# Altium schematic sheet AD_1.SchDoc
size A2; Date: Date; CompanyName: HESSO; Engineer: Name; Address1: Route du Rawyl 47; Address2: 1950 Sion; Address3: Switzerland; DocumentNumber: 6; SheetNumber: 6; SheetTotal: 8; ProjectName: Project Name
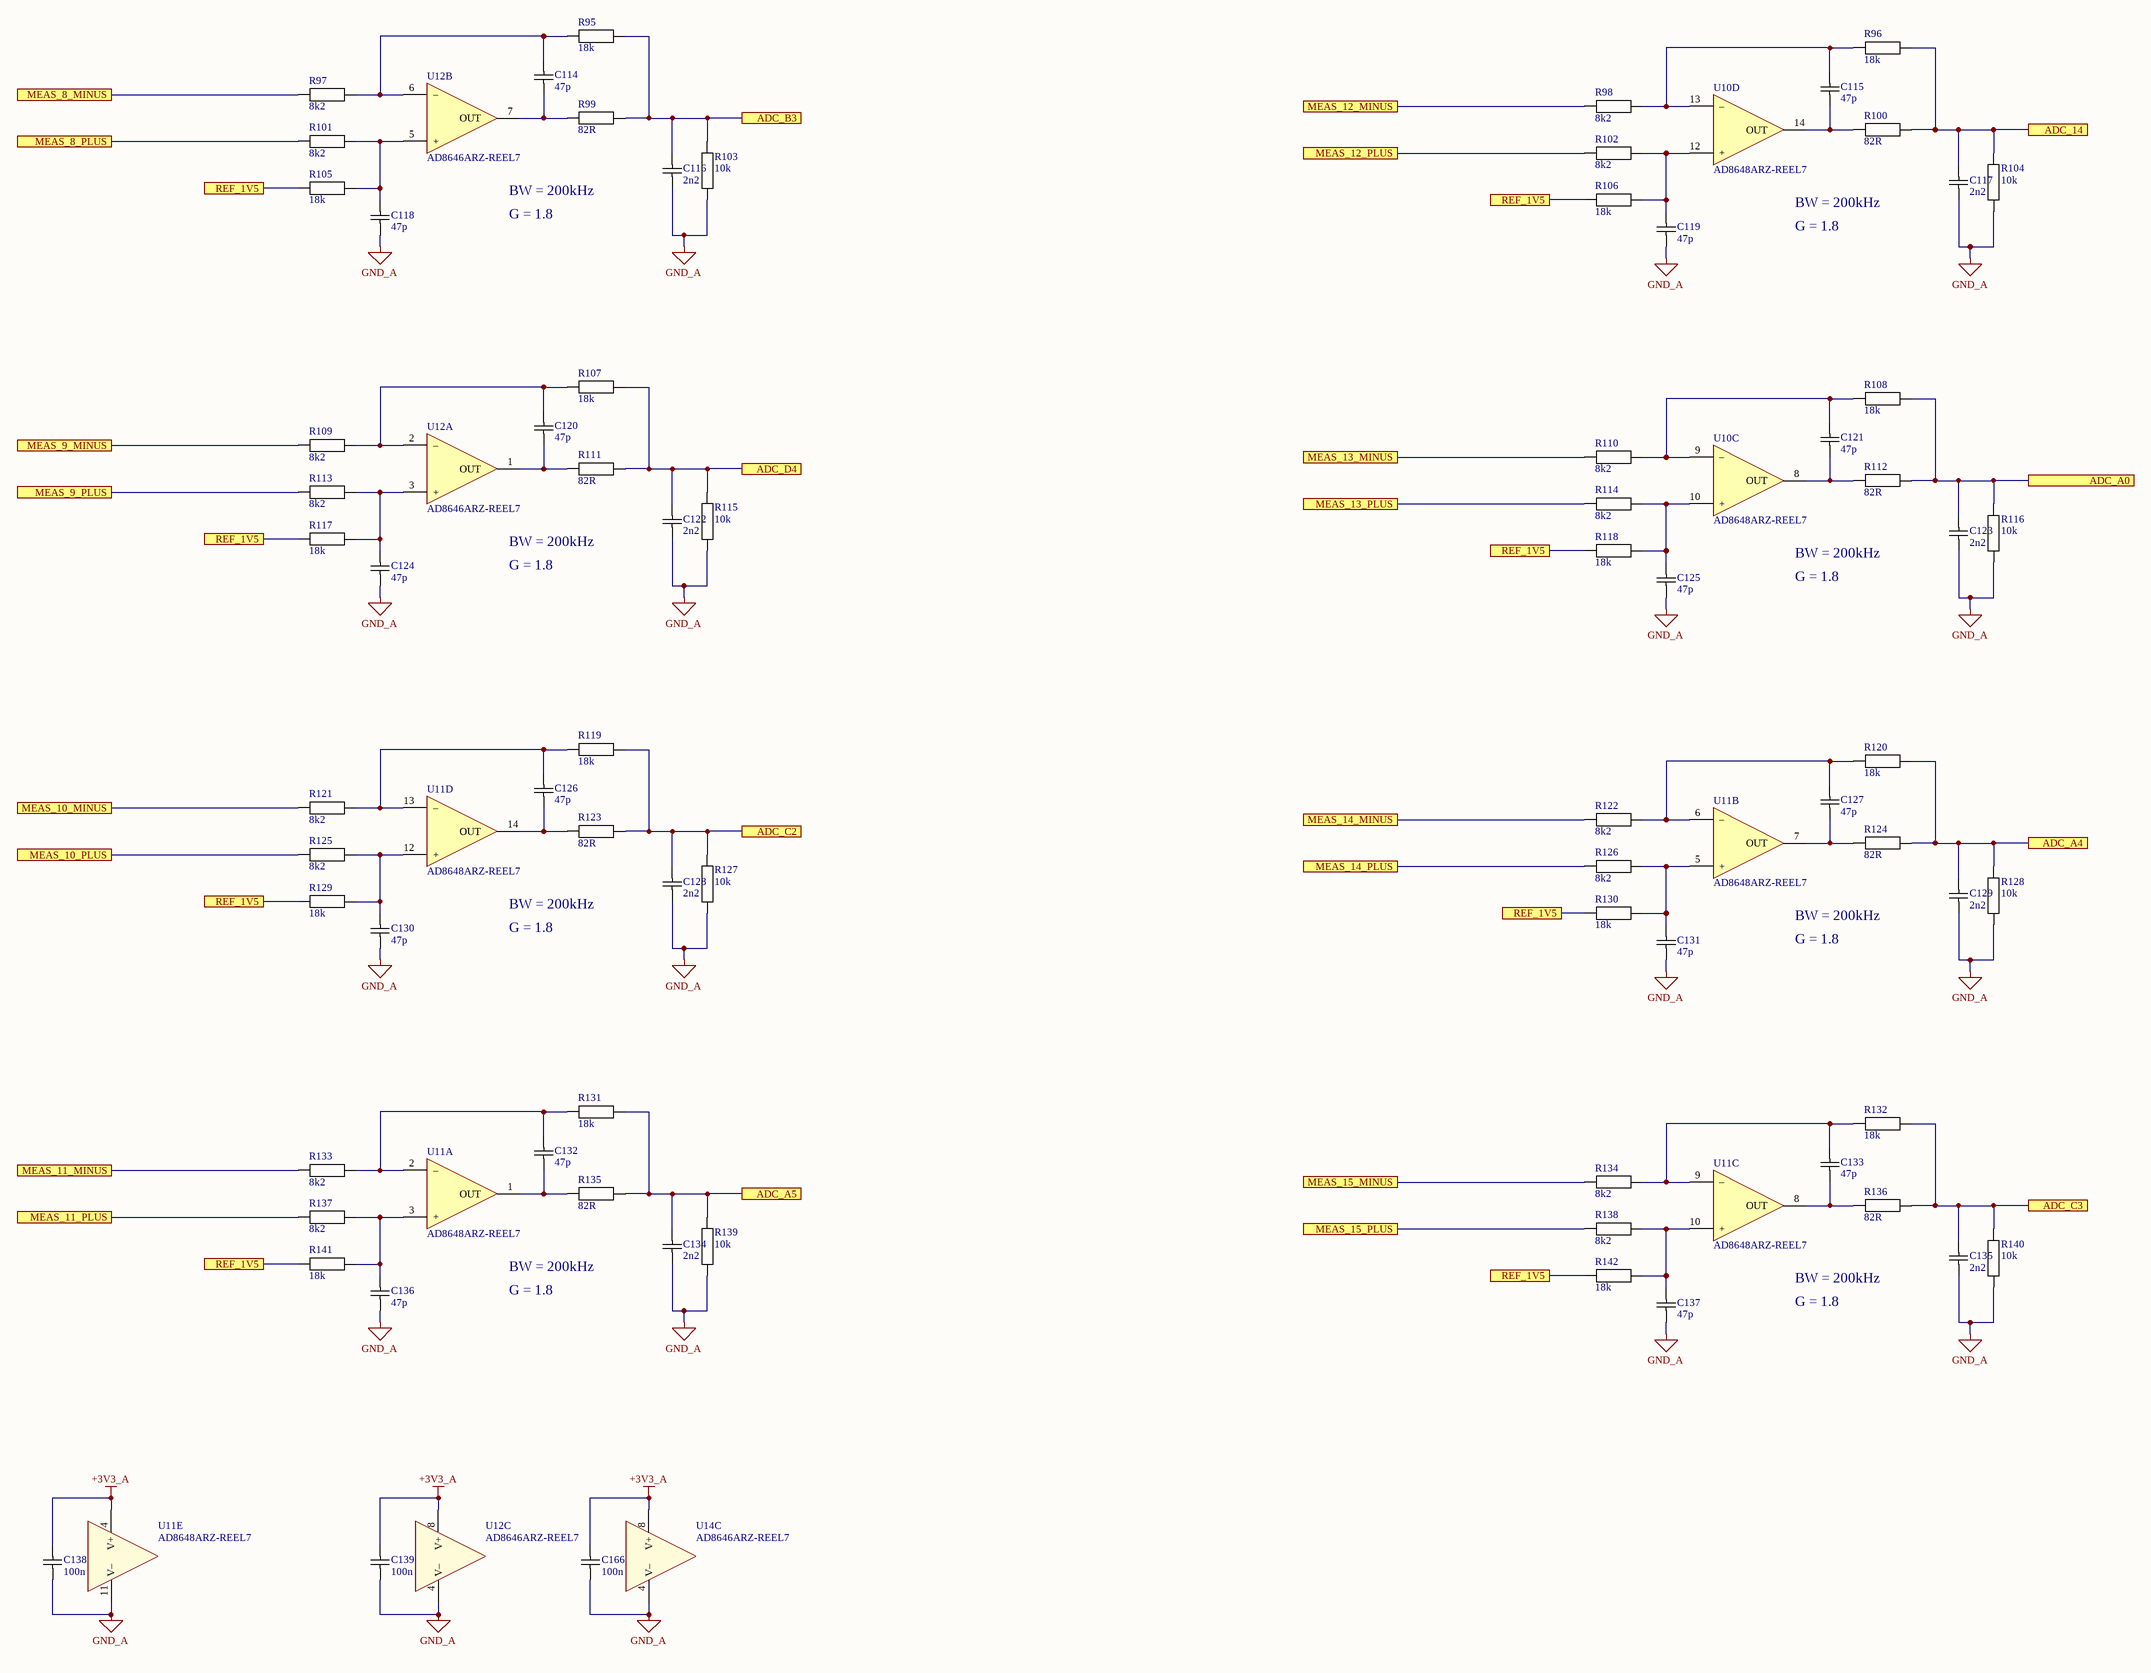
[diagram p0: AD_1.SchDoc]

## Parts
C114  47p  [CAPACITOR 1608 REFLOW]
C115  47p  [CAPACITOR 1608 REFLOW]
C116  2n2  [CAPACITOR 1608 REFLOW]
C117  2n2  [CAPACITOR 1608 REFLOW]
C118  47p  [CAPACITOR 1608 REFLOW]
C119  47p  [CAPACITOR 1608 REFLOW]
C120  47p  [CAPACITOR 1608 REFLOW]
C121  47p  [CAPACITOR 1608 REFLOW]
C122  2n2  [CAPACITOR 1608 REFLOW]
C123  2n2  [CAPACITOR 1608 REFLOW]
C124  47p  [CAPACITOR 1608 REFLOW]
C125  47p  [CAPACITOR 1608 REFLOW]
C126  47p  [CAPACITOR 1608 REFLOW]
C127  47p  [CAPACITOR 1608 REFLOW]
C128  2n2  [CAPACITOR 1608 REFLOW]
C129  2n2  [CAPACITOR 1608 REFLOW]
C130  47p  [CAPACITOR 1608 REFLOW]
C131  47p  [CAPACITOR 1608 REFLOW]
C132  47p  [CAPACITOR 1608 REFLOW]
C133  47p  [CAPACITOR 1608 REFLOW]
C134  2n2  [CAPACITOR 1608 REFLOW]
C135  2n2  [CAPACITOR 1608 REFLOW]
C136  47p  [CAPACITOR 1608 REFLOW]
C137  47p  [CAPACITOR 1608 REFLOW]
C138  100n  [CAPACITOR 1608 REFLOW]
C139  100n  [CAPACITOR 1608 REFLOW]
C166  100n  [CAPACITOR 1608 REFLOW]
R95  18k  [RESISTOR 1608 REFLOW]
R96  18k  [RESISTOR 1608 REFLOW]
R97  8k2  [RESISTOR 1608 REFLOW]
R98  8k2  [RESISTOR 1608 REFLOW]
R99  82R  [RESISTOR 1608 REFLOW]
R100  82R  [RESISTOR 1608 REFLOW]
R101  8k2  [RESISTOR 1608 REFLOW]
R102  8k2  [RESISTOR 1608 REFLOW]
R103  10k  [RESISTOR 1608 REFLOW]
R104  10k  [RESISTOR 1608 REFLOW]
R105  18k  [RESISTOR 1608 REFLOW]
R106  18k  [RESISTOR 1608 REFLOW]
R107  18k  [RESISTOR 1608 REFLOW]
R108  18k  [RESISTOR 1608 REFLOW]
R109  8k2  [RESISTOR 1608 REFLOW]
R110  8k2  [RESISTOR 1608 REFLOW]
R111  82R  [RESISTOR 1608 REFLOW]
R112  82R  [RESISTOR 1608 REFLOW]
R113  8k2  [RESISTOR 1608 REFLOW]
R114  8k2  [RESISTOR 1608 REFLOW]
R115  10k  [RESISTOR 1608 REFLOW]
R116  10k  [RESISTOR 1608 REFLOW]
R117  18k  [RESISTOR 1608 REFLOW]
R118  18k  [RESISTOR 1608 REFLOW]
R119  18k  [RESISTOR 1608 REFLOW]
R120  18k  [RESISTOR 1608 REFLOW]
R121  8k2  [RESISTOR 1608 REFLOW]
R122  8k2  [RESISTOR 1608 REFLOW]
R123  82R  [RESISTOR 1608 REFLOW]
R124  82R  [RESISTOR 1608 REFLOW]
R125  8k2  [RESISTOR 1608 REFLOW]
R126  8k2  [RESISTOR 1608 REFLOW]
R127  10k  [RESISTOR 1608 REFLOW]
R128  10k  [RESISTOR 1608 REFLOW]
R129  18k  [RESISTOR 1608 REFLOW]
R130  18k  [RESISTOR 1608 REFLOW]
R131  18k  [RESISTOR 1608 REFLOW]
R132  18k  [RESISTOR 1608 REFLOW]
R133  8k2  [RESISTOR 1608 REFLOW]
R134  8k2  [RESISTOR 1608 REFLOW]
R135  82R  [RESISTOR 1608 REFLOW]
R136  82R  [RESISTOR 1608 REFLOW]
R137  8k2  [RESISTOR 1608 REFLOW]
R138  8k2  [RESISTOR 1608 REFLOW]
R139  10k  [RESISTOR 1608 REFLOW]
R140  10k  [RESISTOR 1608 REFLOW]
R141  18k  [RESISTOR 1608 REFLOW]
R142  18k  [RESISTOR 1608 REFLOW]
U10  AD8648ARZ-REEL7  [SO14 P1.27 C4.0X8.8 H1.75]  (parts C,D of 5)
U11  AD8648ARZ-REEL7  [SO14 P1.27 C4.0X8.8 H1.75]  (parts A,B,C,D,E of 5)
U12  AD8646ARZ-REEL7  [SO8 P1.27 C4.0X5.0 H1.75]  (parts A,B,C of 3)
U14  AD8646ARZ-REEL7  [SO8 P1.27 C4.0X5.0 H1.75]  (part C of 3)

## Ports
ADC_14, ADC_A0, ADC_A4, ADC_A5, ADC_B3, ADC_C2, ADC_C3, ADC_D4, MEAS_8_MINUS, MEAS_8_PLUS, MEAS_9_MINUS, MEAS_9_PLUS, MEAS_10_MINUS, MEAS_10_PLUS, MEAS_11_MINUS, MEAS_11_PLUS, MEAS_12_MINUS, MEAS_12_PLUS, MEAS_13_MINUS, MEAS_13_PLUS, MEAS_14_MINUS, MEAS_14_PLUS, MEAS_15_MINUS, MEAS_15_PLUS, REF_1V5

## Nets
+3V3_A: C138.2 C139.2 C166.2 U11.4(V+) U12.8(V+) U14.8(V+)
GND_A: C116.1 C117.1 C118.1 C119.1 C122.1 C123.1 C124.1 C125.1 C128.1 C129.1 C130.1 C131.1 C134.1 C135.1 C136.1 C137.1 C138.1 C139.1 C166.1 R103.2 R104.2 R115.2 R116.2 R127.2 R128.2 R139.2 R140.2 U11.11(V–) U12.4(V–) U14.4(V–)
ADC_14: C117.2 R96.2 R100.2 R104.1 ; port ADC_14
ADC_A0: C123.2 R108.2 R112.2 R116.1 ; port ADC_A0
ADC_A4: C129.2 R120.2 R124.2 R128.1 ; port ADC_A4
ADC_A5: C134.2 R131.2 R135.2 R139.1 ; port ADC_A5
ADC_B3: C116.2 R95.2 R99.2 R103.1 ; port ADC_B3
ADC_C2: C128.2 R119.2 R123.2 R127.1 ; port ADC_C2
ADC_C3: C135.2 R132.2 R136.2 R140.1 ; port ADC_C3
ADC_D4: C122.2 R107.2 R111.2 R115.1 ; port ADC_D4
MEAS_8_MINUS: R97.1 ; port MEAS_8_MINUS
MEAS_8_PLUS: R101.1 ; port MEAS_8_PLUS
MEAS_9_MINUS: R109.1 ; port MEAS_9_MINUS
MEAS_9_PLUS: R113.1 ; port MEAS_9_PLUS
MEAS_10_MINUS: R121.1 ; port MEAS_10_MINUS
MEAS_10_PLUS: R125.1 ; port MEAS_10_PLUS
MEAS_11_MINUS: R133.1 ; port MEAS_11_MINUS
MEAS_11_PLUS: R137.1 ; port MEAS_11_PLUS
MEAS_12_MINUS: R98.1 ; port MEAS_12_MINUS
MEAS_12_PLUS: R102.1 ; port MEAS_12_PLUS
MEAS_13_MINUS: R110.1 ; port MEAS_13_MINUS
MEAS_13_PLUS: R114.1 ; port MEAS_13_PLUS
MEAS_14_MINUS: R122.1 ; port MEAS_14_MINUS
MEAS_14_PLUS: R126.1 ; port MEAS_14_PLUS
MEAS_15_MINUS: R134.1 ; port MEAS_15_MINUS
MEAS_15_PLUS: R138.1 ; port MEAS_15_PLUS
REF_1V5: R105.2 R106.2 R117.2 R118.2 R129.2 R130.2 R141.2 R142.2 ; port REF_1V5
NetC114_1: C114.1 R99.1 U12.7(OUT)
NetC114_2: C114.2 R95.1 R97.2 U12.6(–)
NetC115_1: C115.1 R100.1 U10.14(OUT)
NetC115_2: C115.2 R96.1 R98.2 U10.13(–)
NetC118_2: C118.2 R101.2 R105.1 U12.5(+)
NetC119_2: C119.2 R102.2 R106.1 U10.12(+)
NetC120_1: C120.1 R111.1 U12.1(OUT)
NetC120_2: C120.2 R107.1 R109.2 U12.2(–)
NetC121_1: C121.1 R112.1 U10.8(OUT)
NetC121_2: C121.2 R108.1 R110.2 U10.9(–)
NetC124_2: C124.2 R113.2 R117.1 U12.3(+)
NetC125_2: C125.2 R114.2 R118.1 U10.10(+)
NetC126_1: C126.1 R123.1 U11.14(OUT)
NetC126_2: C126.2 R119.1 R121.2 U11.13(–)
NetC127_1: C127.1 R124.1 U11.7(OUT)
NetC127_2: C127.2 R120.1 R122.2 U11.6(–)
NetC130_2: C130.2 R125.2 R129.1 U11.12(+)
NetC131_2: C131.2 R126.2 R130.1 U11.5(+)
NetC132_1: C132.1 R135.1 U11.1(OUT)
NetC132_2: C132.2 R131.1 R133.2 U11.2(–)
NetC133_1: C133.1 R136.1 U11.8(OUT)
NetC133_2: C133.2 R132.1 R134.2 U11.9(–)
NetC136_2: C136.2 R137.2 R141.1 U11.3(+)
NetC137_2: C137.2 R138.2 R142.1 U11.10(+)

## Notes on the sheet
- BW = 200kHz
- G = 1.8
- Date :
- Revision :
- Sheet
- of
- Design by :

## Library data of the parts
C114-C139 C166 = Capacitor: Capacitor X7R 10% 50V 1608(0603)
  C114 C115 C118-C121 C124-C127 C130-C133 C136 C137: Value: 47p
  C116 C117 C122 C123 C128 C129 C134 C135: Value: 2n2
  C138 C139 C166: Value: 100n
R95-R142 = Resistor: Resistor 1% 50V 100mW 1608(0603)
  R95 R96 R105-R108 R117-R120 R129-R132 R141 R142: Value: 18k
  R97 R98 R101 R102 R109 R110 R113 R114 R121 R122 R125 R126 R133 R134 R137 R138: Value: 8k2
  R99 R100 R111 R112 R123 R124 R135 R136: Value: 82R
  R103 R104 R115 R116 R127 R128 R139 R140: Value: 10k
U10 U11 = OPA QUAD: Generic quad OPA 14 pins; Manufacturer: Analog Devices; Value: AD8648ARZ-REEL7; Mouser No.: 584-AD8648ARZ-R7
U12 U14 = OPA DUAL: Generic dual OPA 8 pins; Manufacturer: Analog Devices; Value: AD8646ARZ-REEL7; Mouser No.: 584-AD8646ARZ-R7